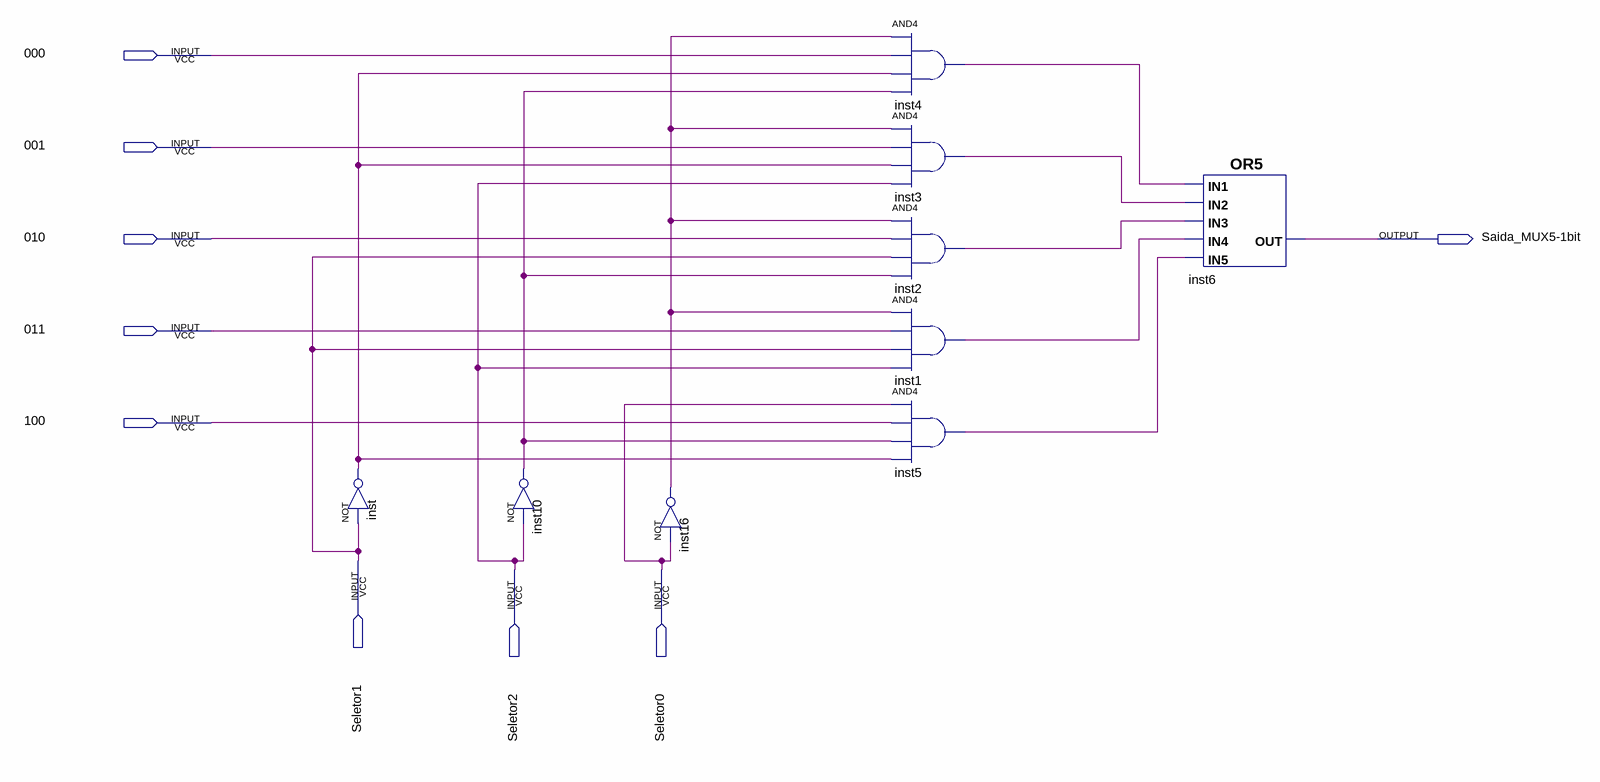
[diagram p0: schematic sheet]
// Quartus schematic MUX5-1bit.bdf as structural Verilog: 9 symbols, 9 pins
module \MUX5-1bit  (
  input  \000 ,
  input  \001 ,
  input  \010 ,
  input  \011 ,
  input  \100 ,
  input  Seletor1,
  input  Seletor2,
  input  Seletor0,
  output \Saida_MUX5-1bit 
);

  wire inst1_out, inst2_out, inst3_out, inst4_out, inst5_out, inst10_out, inst16_out, inst_out;

  not inst (inst_out, Seletor1);
  not inst10 (inst10_out, Seletor2);
  not inst16 (inst16_out, Seletor0);
  and inst4 (inst4_out, inst16_out, \000 , inst_out, inst10_out);
  and inst3 (inst3_out, inst16_out, \001 , inst_out, Seletor2);
  and inst2 (inst2_out, inst16_out, \010 , Seletor1, inst10_out);
  and inst1 (inst1_out, inst16_out, \011 , Seletor1, Seletor2);
  and inst5 (inst5_out, Seletor0, \100 , inst10_out, inst_out);
  or inst6 (\Saida_MUX5-1bit , inst4_out, inst3_out, inst2_out, inst1_out, inst5_out);
endmodule
